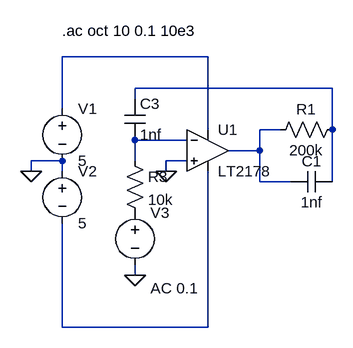
[diagram p0: schematic DRL.asc]
DRL.asc, the LTspice schematic file:
Version 4
SHEET 1 880 680
WIRE 144 16 -80 16
WIRE 336 64 32 64
WIRE 32 80 32 64
WIRE -80 96 -80 16
WIRE 144 128 144 16
WIRE 256 128 224 128
WIRE 336 128 336 64
WIRE 112 144 32 144
WIRE 224 160 224 128
WIRE 224 160 176 160
WIRE -80 176 -128 176
WIRE 32 176 32 144
WIRE 112 176 80 176
WIRE -128 192 -128 176
WIRE -80 192 -80 176
WIRE 80 192 80 176
WIRE 224 208 224 160
WIRE 272 208 224 208
WIRE 336 208 336 128
WIRE 32 352 32 336
WIRE -80 432 -80 272
WIRE 144 432 144 192
WIRE 144 432 -80 432
FLAG -128 192 0
FLAG 32 352 0
FLAG 80 192 0
SYMBOL Opamps\\LT2178 144 96 R0
SYMATTR InstName U1
SYMBOL voltage -80 80 R0
WINDOW 123 0 0 Left 0
WINDOW 39 0 0 Left 0
SYMATTR InstName V1
SYMATTR Value 5
SYMBOL voltage -80 176 R0
WINDOW 123 0 0 Left 0
WINDOW 39 0 0 Left 0
SYMATTR InstName V2
SYMATTR Value 5
SYMBOL voltage 32 240 R0
WINDOW 123 24 132 Left 0
WINDOW 39 0 0 Left 0
SYMATTR InstName V3
SYMATTR Value ""
SYMATTR Value2 AC 0.1
SYMBOL res 352 112 R90
WINDOW 0 0 56 VBottom 0
WINDOW 3 32 56 VTop 0
SYMATTR InstName R1
SYMATTR Value 200k
SYMBOL cap 336 192 R90
WINDOW 0 0 32 VBottom 0
WINDOW 3 32 32 VTop 0
SYMATTR InstName C1
SYMATTR Value 1nf
SYMBOL res 16 160 R0
SYMATTR InstName R3
SYMATTR Value 10k
SYMBOL cap 16 80 R0
SYMATTR InstName C3
SYMATTR Value 1nf
TEXT -80 -24 Left 0 !.ac oct 10 0.1 10e3

The netlist it stands for:
* DRL.asc
XU1 0 N004 N001 N005 N003 LT2178  ; pins In+ In- V+ V- OUT
V1 N001 0 5
V2 0 N005 5
V3 P001 0 AC 0.1
R1 N002 N003 200k
C1 N002 N003 1nf
R3 N004 P001 10k
C3 N002 N004 1nf
.ac oct 10 0.1 10e3
.backanno
.end